# EAGLE board Cmde moteurs_5 (EAGLE 6.5.0), part 1 of 3
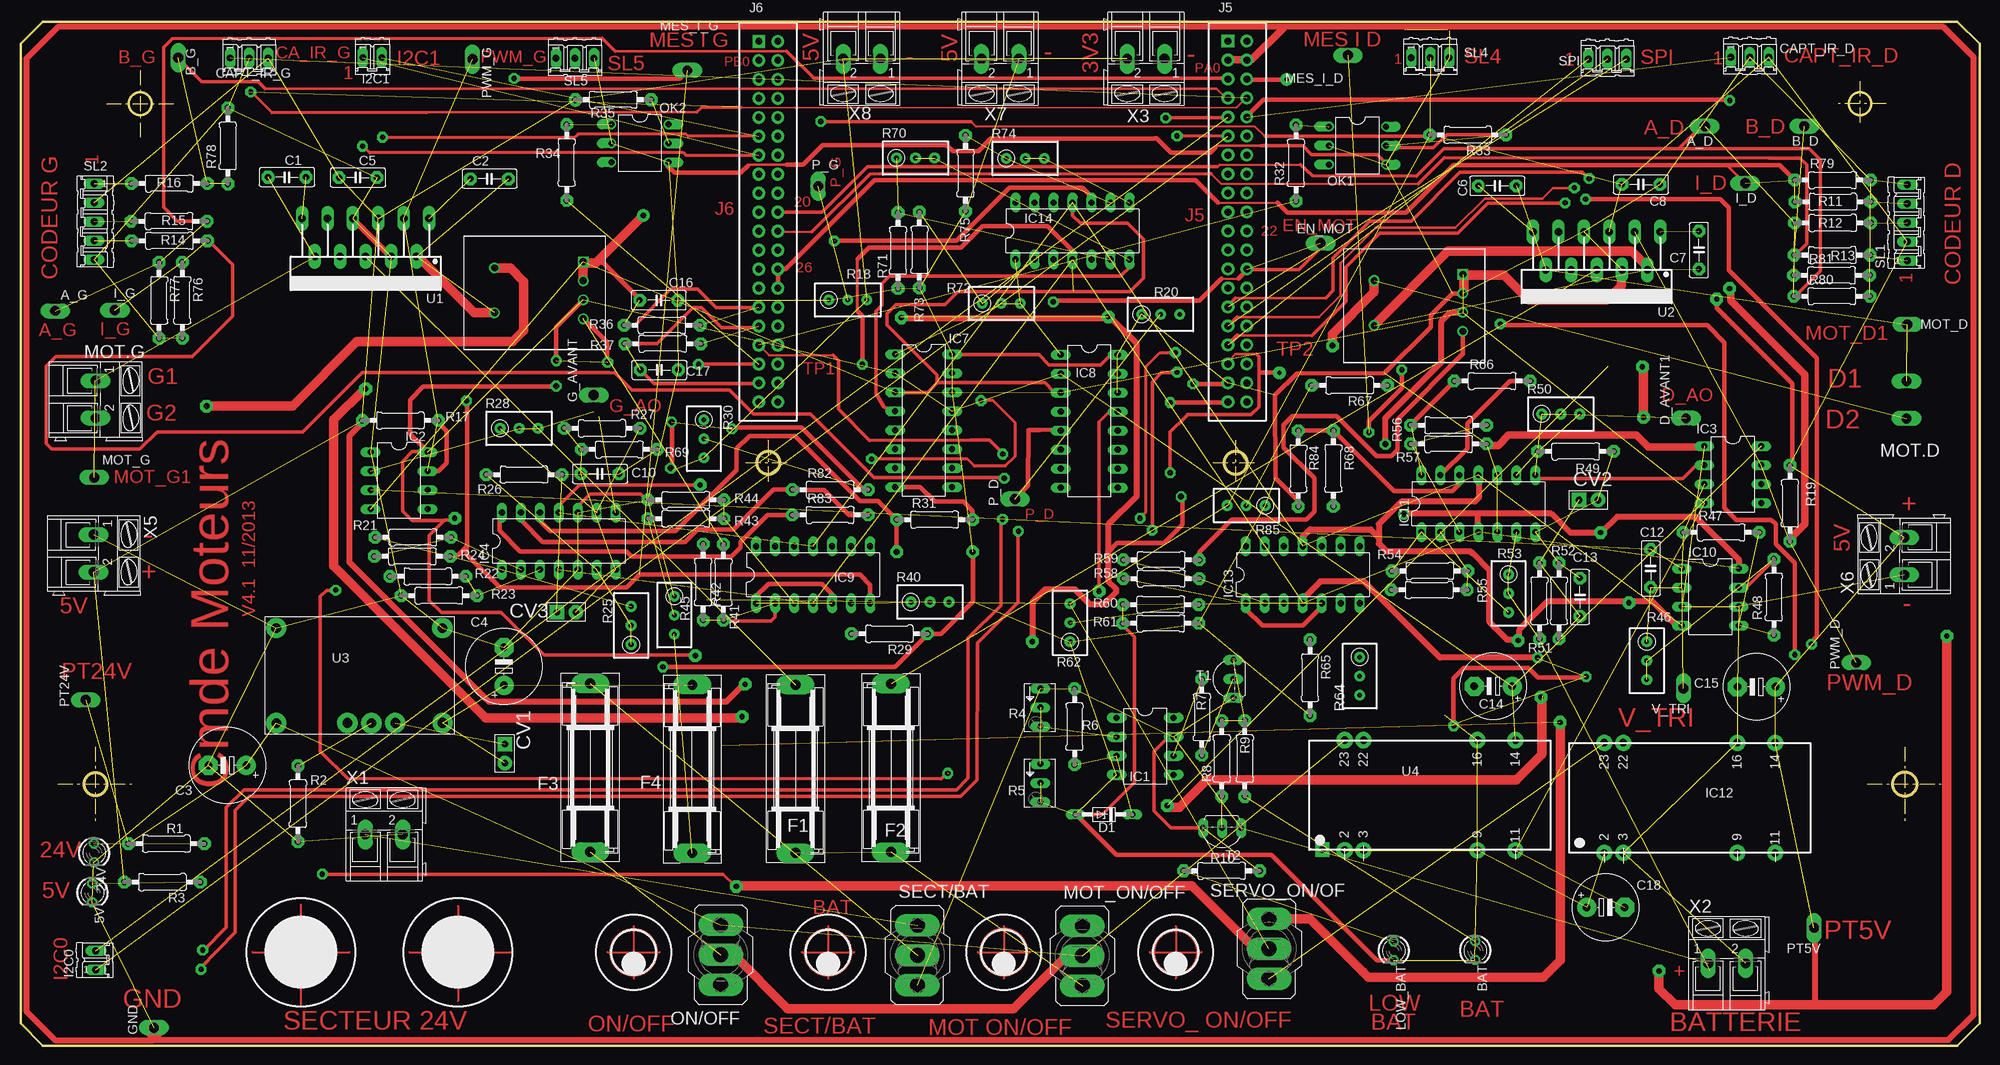
[diagram p3: board, top side]
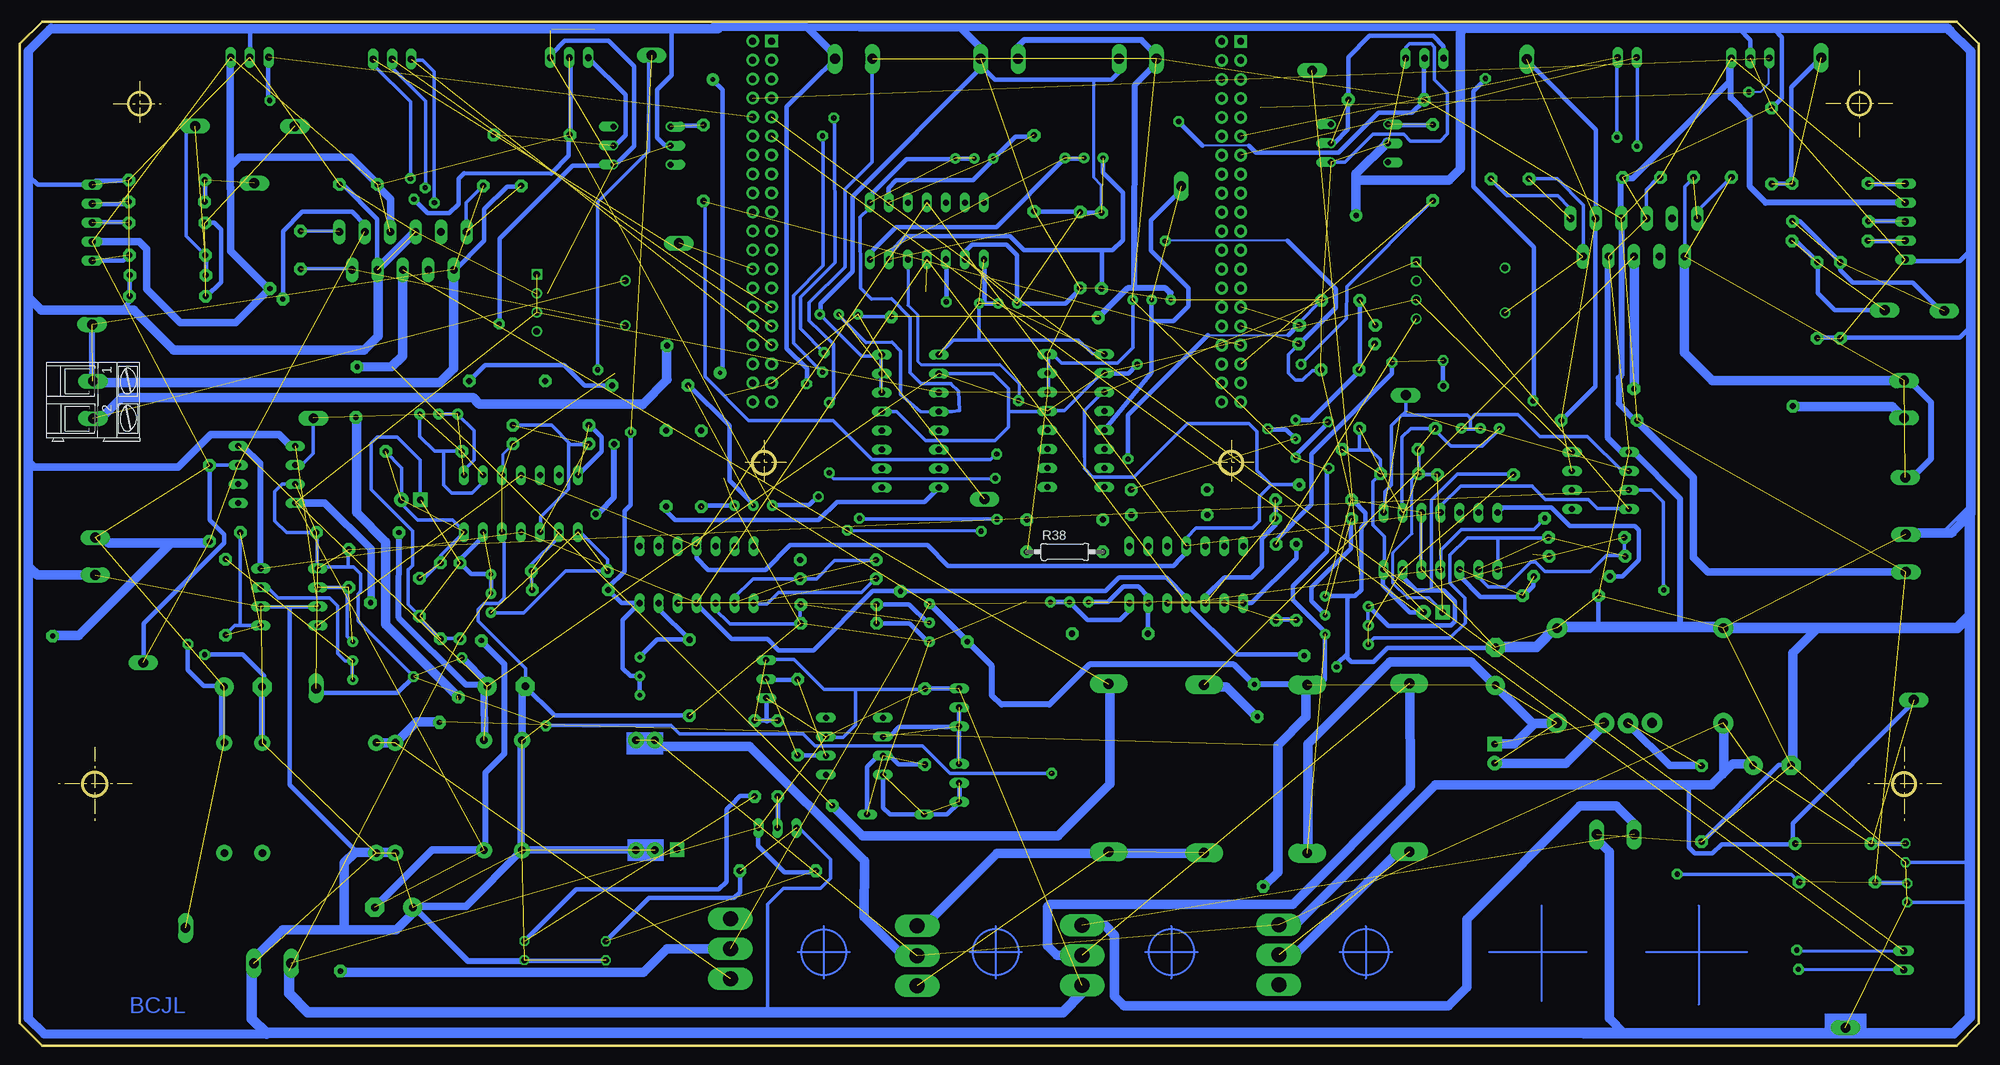
[diagram p4: board, bottom side, seen from below]

Size 262 x 137 mm. Coordinates in mm from the lower left corner, seen from the top.
Outline: 65,137 3,137
Outline: 3,137 259,137 262,134 262,3 259,0 3,0 0,3 0,134 3,137
Outline: 247,35 257,35
Outline: 252,40 252,30
Outline: 5,35 15,35
Outline: 10,40 10,30
Outline: 97,78 103,78
Outline: 100,81 100,75
Outline: 159.5,78 165.5,78
Outline: 162.5,81 162.5,75
Outline: 11.5,126 20.5,126
Outline: 16,130.5 16,121.5
Outline: 249.5,126 242.5,126
Outline: 246,129 246,123
Outline: circle at 10,35 radius 1.5
Outline: circle at 100,78 radius 1.5
Outline: circle at 162.5,78 radius 1.5
Outline: circle at 252,35 radius 1.58
Outline: circle at 246,126 radius 1.5
Outline: circle at 16,126 radius 1.5
Copper layers (1*16): Top 0.035mm / dielectric 1.5mm / Bottom 0.035mm
Design rules "default": minimum track width 10mil, minimum drill 24mil, track to track 8mil, track to pad 8mil, pad to pad 8mil, via to via 8mil, smd to smd 8mil, copper to edge 40mil, drill to drill 8mil, minimum pad ring 10mil, minimum via ring 8mil, stop-mask expansion 4mil, vias tented up to drill 0mil, thermal gap 10mil
tRestrict: area 97,75 to 103,81; area 159.5,75 to 165.5,81; area 249,124 to 255,130; area 249,32 to 255,38; area 7,32 to 13,38; area 7,124 to 13,130

## Footprints (pad centres in the part's own frame; a part is rotated, then mirrored left to right if it is on the bottom)
LED3MM = drill 0.813 octagon: A -1.27,0; K 1.27,0
P1-13Y = drill 1.321 pad 1.905 long: TP 0,0
C050-025X075 = drill 0.813 pad 1.676 octagon: 1 -2.54,0; 2 2.54,0
E5-10,5 = drill 1.016 pad 2.54: + -2.54,0 | drill 1.016 pad 2.54 octagon: - 2.54,0
E5-8,5 = drill 1.016 pad 2.54: + -2.54,0 | drill 1.016 pad 2.54 octagon: - 2.54,0
03P = drill 0.914 long: 1 -2.54,0; 2 0,0; 3 2.54,0
CAVALIER = drill 0.9 pad 1.93 square: 1 -1.27,0 | drill 0.9 pad 1.93: 2 1.27,0
DO34Z7 = drill 0.813 long: A 3.81,0; C -3.81,0
SH22,5 = drill 1.321 pad 2.54 long: 1 -11.252,0; 2 11.252,0
02P = drill 0.914 long: 1 -1.27,0; 2 1.27,0
DIL08 = drill 0.813 pad 1.27 long: 1 -3.81,-3.81; 2 -1.27,-3.81; 3 1.27,-3.81; 4 3.81,-3.81; 5 3.81,3.81; 6 1.27,3.81; 7 -1.27,3.81; 8 -3.81,3.81
DIL14 = drill 0.813 long: 1 -7.62,-3.81; 2 -5.08,-3.81; 3 -2.54,-3.81; 4 0,-3.81; 5 2.54,-3.81; 6 5.08,-3.81; 7 7.62,-3.81; 8 7.62,3.81; 9 5.08,3.81; 10 2.54,3.81; 11 0,3.81; 12 -2.54,3.81; 13 -5.08,3.81; 14 -7.62,3.81
DIL16 = drill 0.813 long: 1 -8.89,-3.81; 2 -6.35,-3.81; 3 -3.81,-3.81; 4 -1.27,-3.81; 5 1.27,-3.81; 6 3.81,-3.81; 7 6.35,-3.81; 8 8.89,-3.81; 9 8.89,3.81; 10 6.35,3.81; 11 3.81,3.81; 12 1.27,3.81; 13 -1.27,3.81; 14 -3.81,3.81; 15 -6.35,3.81; 16 -8.89,3.81
NDTS05505 = drill 1 pad 2.184: 2 -11.43,-7.36; 3 -8.89,-7.36; 9 6.35,-7.36; 11 11.43,-7.36; 14 11.43,7.36; 16 6.35,7.36; 22 -8.89,7.36; 23 -11.43,7.36
CON_FE20-2 = drill 0.9 pad 1.676 square: 1 -1.27,24.13 | drill 0.9 pad 1.676: 2 1.27,24.13; 3 -1.27,21.59; 4 1.27,21.59; 5 -1.27,19.05; 6 1.27,19.05; 7 -1.27,16.51; 8 1.27,16.51; 9 -1.27,13.97; 10 1.27,13.97; 11 -1.27,11.43; 12 1.27,11.43; 13 -1.27,8.89; 14 1.27,8.89; 15 -1.27,6.35; 16 1.27,6.35; 17 -1.27,3.81; 18 1.27,3.81; 19 -1.27,1.27; 20 1.27,1.27; 21 -1.27,-1.27; 22 1.27,-1.27; 23 -1.27,-3.81; 24 1.27,-3.81; 25 -1.27,-6.35; 26 1.27,-6.35; 27 -1.27,-8.89; 28 1.27,-8.89; 29 -1.27,-11.43; 30 1.27,-11.43; 31 -1.27,-13.97; 32 1.27,-13.97; 33 -1.27,-16.51; 34 1.27,-16.51; 35 -1.27,-19.05; 36 1.27,-19.05; 37 -1.27,-21.59; 38 1.27,-21.59; 39 -1.27,-24.13; 40 1.27,-24.13
AK300/2 = drill 1.321 long: 1 -2.515,0; 2 2.489,0
320-916 = drill 2.007 long: 1 0,4.013; 2 0,0; 3 0,-4.013
DIL06 = drill 0.813 offset: 1 -2.54,-3.81; 2 0,-3.81; 3 2.54,-3.81; 4 2.54,3.81; 5 0,3.81; 6 -2.54,3.81
0207/10 = drill 0.813 pad 1.676 octagon: 1 -5.08,0; 2 5.08,0
B64Y = drill 0.813 long: A 2.54,0; E -2.54,0; S 0,0
RTRIM3296W = drill 0.61 pad 1.422: 1 0,-2.54; 2 0,0; 3 0,2.54
05P = drill 0.914 long: 1 -5.08,0; 2 -2.54,0; 3 0,0; 4 2.54,0; 5 5.08,0
TO92-EBC = drill 0.813 long: B 0,-1.27; C 2.54,-1.27; E -2.54,-1.27
MULTIWATT_11 = drill 1 pad 1.676 long: 1 -8.5,-7.33; 2 -6.8,-2.25; 3 -5.1,-7.33; 4 -3.4,-2.25; 5 -1.7,-7.33; 6 0,-2.25; 7 1.7,-7.33; 8 3.4,-2.25; 9 5.1,-7.33; 10 6.8,-2.25; 11 8.5,-7.33
PTN78060 = drill 1.3 pad 2.7: 1 -11.12,6.36; 2 -11.11,-6.35; 3 -1.6,-6.34; 4 1.61,-6.35; 5 4.8,-6.34; 6 11.12,-6.34; 7 11.11,6.36
HX03 = drill 0.9 square: P1 0,-7.62 | drill 0.9: P2 0,-5.08; P3 0,-2.54; P4 0,0; P5 11.85,-6.8; P6 11.85,-0.8

## Placement (x,y rotation side)
5V  [LED3MM]  9.6,20.46 270 top
24V  [LED3MM]  9.82,25.78 270 top
A_D  PTR1PAD1-13Y  [P1-13Y]  225.24,122.99 90 top
A_G  PTR1PAD1-13Y  [P1-13Y]  4.65,98.3 270 top
B_D  PTR1PAD1-13Y  [P1-13Y]  238.58,123.02 270 top
B_G  PTR1PAD1-13Y  [P1-13Y]  21.1,132.15 0 top
BAT  Vert  [LED3MM]  194.54,12.72 270 top
C1  10n  [C050-025X075]  35.64,116.18 180 top
C2  10n  [C050-025X075]  62.73,115.95 180 top
C3  220µ  [E5-10,5]  27.67,37.49 180 top
C4  220µ  [E5-10,5]  64.65,50.74 90 top
C5  100n  [C050-025X075]  45.13,116.12 180 top
C6  10n  [C050-025X075]  197.5,115.03 0 top
C7  10n  [C050-025X075]  224.49,106.43 90 top
C8  100n  [C050-025X075]  216.72,115.2 180 top
C10  100n  [C050-025X075]  77.5,76.5 180 top
C12  1nF  [C050-025X075]  218.02,63.84 270 top
C13  100n  [C050-025X075]  208.55,60 270 top
C14  220µ  [E5-8,5]  196.97,48.09 180 top
C15  220µ  [E5-8,5]  232.17,48 180 top
C16  47nF  [C050-025X075]  85.36,99.72 0 top
C17  47nF  [C050-025X075]  85.44,90.4 0 top
C18  220µ  [E5-8,5]  212,18.5 0 top
CAPT_IR_D  [03P]  231.28,132.21 0 top
CAPT_IR_G  [03P]  30.57,132.12 0 top
CV1  [CAVALIER]  64.77,39.08 270 top
CV2  [CAVALIER]  209.71,73 0 top
CV3  [CAVALIER]  73,58 0 top
D1  20V  [DO34Z7]  144.89,30.92 180 top
D_AVANT1  PTR1PAD1-13Y  [P1-13Y]  222.76,83.93 90 top
EN_MOT  PTR1PAD1-13Y  [P1-13Y]  173.88,107.33 90 top
F1  [SH22,5]  103.64,37.03 270 top
F2  [SH22,5]  116.41,37.16 270 top
F3  [SH22,5]  76.18,37.19 270 top
F4  [SH22,5]  89.85,37.01 90 top
G_AVANT  PTR1PAD1-13Y  [P1-13Y]  76.67,87.02 90 top
GND  PTR1PAD1-13Y  [P1-13Y]  17.85,2.4 90 top
I2C0  [02P]  10.08,11.44 90 top
I2C1  [02P]  47.06,132.18 0 top
I_D  PTR1PAD1-13Y  [P1-13Y]  230.66,115.37 270 top
I_G  PTR1PAD1-13Y  [P1-13Y]  12.62,98.37 270 top
IC1  TL081P  [DIL08]  150.4,40.04 270 top
IC2  LM311N  [DIL08]  50.62,75.6 270 top
IC3  LM311N  [DIL08]  229,76.4 270 top
IC4  TL084P  [DIL14]  72,67.5 0 top
IC7  [DIL16]  120.78,83.62 270 top
IC8  [DIL16]  142.93,83.54 270 top
IC9  TL084P  [DIL14]  106,63 0 top
IC10  TL082P  [DIL08]  226,60 270 top
IC11  TL084P  [DIL14]  195,72.5 0 top
IC12  [NDTS05505]  223.25,33.15 0 top
IC13  TL084P  [DIL14]  171.5,63 0 top
IC14  TL084P  [DIL14]  140.7,108.99 0 top
J5  [CON_FE20-2]  162.75,110.24 0 top
J6  [CON_FE20-2]  100,110.23 0 top
LOW_BAT  Rouge  [LED3MM]  183.64,12.7 270 top
MES_I_D  PTR1PAD1-13Y  [P1-13Y]  177.53,132.47 270 top
MES_I_G  PTR1PAD1-13Y  [P1-13Y]  89.18,130.46 90 top
MOT.D  [AK300/2]  252.24,86.39 270 bottom
MOT.G  [AK300/2]  10.02,86.45 270 top
MOT_D  PTR1PAD1-13Y  [P1-13Y]  252.35,96.48 90 top
MOT_G  PTR1PAD1-13Y  [P1-13Y]  9.85,76.01 90 top
MOT_ON/OFF  [320-916]  142,12 0 top
OK1  4N27  [DIL06]  178.81,120.42 270 top
OK2  4N27  [DIL06]  82.85,120.71 270 top
ON/OFF  [320-916]  93.65,12.18 180 top
P_D  PTR1PAD1-13Y  [P1-13Y]  133,73.11 90 top
P_G  PTR1PAD1-13Y  [P1-13Y]  106.69,114.98 0 top
PT5V  PTR1PAD1-13Y  [P1-13Y]  239.86,15.75 180 top
PT24V  PTR1PAD1-13Y  [P1-13Y]  8.73,46.24 90 top
PWM_D  PTR1PAD1-13Y  [P1-13Y]  245.52,51.24 90 top
PWM_G  PTR1PAD1-13Y  [P1-13Y]  60.44,131.95 0 top
R1  2K  [0207/10]  19.51,27.03 180 top
R2  21K  [0207/10]  37.1,32.38 90 top
R3  270  [0207/10]  18.96,21.89 180 top
R4  22k  [B64Y]  136.4,45.24 270 top
R5  22k  [B64Y]  136.4,35.13 270 top
R6  6.2k  [0207/10]  140.97,42.67 90 top
R7  1k  [0207/10]  158,43.93 90 top
R8  1k  [0207/10]  160.65,38.41 90 top
R9  2k  [0207/10]  163.73,38.41 90 top
R10  2k  [0207/10]  160.64,23.39 0 top
R11  3K3  [0207/10]  242.38,112.88 180 top
R12  3K3  [0207/10]  242.36,110.06 180 top
R13  3K3  [0207/10]  242.3,105.75 180 top
R14  3K3  [0207/10]  19.93,107.67 0 top
R15  3K3  [0207/10]  19.88,110.29 0 top
R16  3K3  [0207/10]  19.91,115.33 0 top
R17  10k  [0207/10]  50.79,83.64 180 top
R18  10K  [RTRIM3296W]  110.64,99.75 270 top
R19  10k  [0207/10]  236.65,72.55 90 top
R20  10K  [RTRIM3296W]  152.47,97.84 270 top
R21  47k  [0207/10]  52.5,68 0 top
R22  47k  [0207/10]  54.46,62.78 180 top
R23  47k  [0207/10]  55.98,60.2 0 top
R24  47k  [0207/10]  52.4,65.46 0 top
R25  100k  [RTRIM3296W]  81.66,56.21 0 top
R26  10k  [0207/10]  67.34,76.39 180 top
R27  10k  [0207/10]  77.78,82.59 180 top
R28  100k  [RTRIM3296W]  66.68,82.58 270 top
R29  10k  [0207/10]  116.2,55.11 180 top
R30  1k  [RTRIM3296W]  91.4,81.19 180 top
R31  47k  [0207/10]  122.25,70.36 0 top
R32  470  [0207/10]  170.59,118.08 90 top
R33  4.7k  [0207/10]  193.56,121.84 180 top
R34  470  [0207/10]  73.04,118.14 270 top
R35  4.7k  [0207/10]  79.28,126.54 0 top
R36  0.6K  [0207/10]  85.8,96.38 0 top
R37  0.6K  [0207/10]  85.9,93.9 0 top
R38  47k  [0207/10]  122.26,66.06 0 bottom
R40  100k  [RTRIM3296W]  121.64,59.35 270 top
R41  47k  [0207/10]  94,62 270 top
R42  47k  [0207/10]  91.29,62.02 90 top
R43  47k  [0207/10]  89,70.5 0 top
R44  47k  [0207/10]  89,73 0 top
R45  1k  [RTRIM3296W]  87.42,57.59 180 top
R46  100K  [RTRIM3296W]  217.5,51.5 180 top
R47  3.3k  [0207/10]  227.46,68.66 0 top
R48  6.6k  [0207/10]  234.5,60 90 top
R49  10k  [0207/10]  208,79.5 0 top
R50  100K  [RTRIM3296W]  206,84.5 270 top
R51  10k  [0207/10]  203.14,59.5 270 top
R52  47k  [0207/10]  205.75,59.5 270 top
R53  100K  [RTRIM3296W]  199,60.5 180 top
R54  47k  [0207/10]  188.5,63.5 0 top
R55  47k  [0207/10]  188.4,60.97 180 top
R56  47k  [0207/10]  191,83 180 top
R57  47k  [0207/10]  191,80.5 0 top
R58  47k  [0207/10]  152.57,62.49 0 top
R59  47k  [0207/10]  152.57,64.98 0 top
R60  47k  [0207/10]  152.5,59 0 top
R61  47k  [0207/10]  152.5,56.5 0 top
R62  1k  [RTRIM3296W]  140.36,56.56 0 top
R64  100K  [RTRIM3296W]  179.11,49.45 180 top
R65  10k  [0207/10]  172.47,49.23 270 top
R66  47k  [0207/10]  196.84,88.92 0 top
R67  47k  [0207/10]  177.75,88.33 180 top
R68  47k  [0207/10]  175.59,77.21 270 top
R69  47k  [0207/10]  80.1,79.75 0 top
R70  50k  [RTRIM3296W]  119.7,118.74 270 top
R71  10k  [0207/10]  117.36,106.37 90 top
R72  50k  [RTRIM3296W]  131.18,99.29 270 top
R73  10k  [0207/10]  120.22,106.45 90 top
R74  50k  [RTRIM3296W]  134.36,118.69 270 top
R75  10k  [0207/10]  126.38,116.7 90 top
R76  6K6  [0207/10]  21.63,99.72 270 top
R77  6K6  [0207/10]  18.53,99.7 270 top
R78  6K6  [0207/10]  27.73,120.36 90 top
R79  6K6  [0207/10]  242.36,115.79 0 top
R80  6K6  [0207/10]  242.25,100.26 0 top
R81  6K6  [0207/10]  242.23,103.05 0 top
R82  47k  [0207/10]  108.3,74.37 0 top
R83  47k  [0207/10]  108.28,71 0 top
R84  47k  [0207/10]  170.89,77.2 270 top
R85  1k  [RTRIM3296W]  163.93,72.25 90 top
SECT/BAT  [320-916]  119.95,12.12 0 top
SERVO_ON/OF  [320-916]  166.99,12.98 0 top
SL1  Codeur D  [05P]  252.35,110.08 90 top
SL2  Codeur G  [05P]  9.85,110.22 270 top
SL4  [03P]  188.53,132.17 0 top
SL5  [03P]  74.14,132.07 0 top
SPI  [03P]  212.21,131.98 0 top
T1  BC327  [TO92-EBC]  160.92,49.04 90 top
T2  BC327  [TO92-EBC]  160.69,27.85 180 top
U1  LMD18200  [MULTIWATT_11]  46.15,103.32 180 top
U2  LMD18200  [MULTIWATT_11]  210.79,101.55 180 top
U3  [PTN78060]  45.32,49.5 0 top
U4  [NDTS05505]  188.5,33.5 0 top
U$1  HX03  [HX03]  192.9,95.54 180 top
U$2  HX03  [HX03]  75.25,97.25 180 top
V_TRI  V_TRI  [P1-13Y]  222.39,47.81 180 top
X1  [AK300/2]  48.62,28.25 0 top
X2  [AK300/2]  228.22,11.03 0 top
X3  3V3  [AK300/2]  150.5,132 180 top
X5  [AK300/2]  9.78,65.84 270 top
X6  [AK300/2]  251.94,65.49 90 top
X7  [AK300/2]  131,132 180 top
X8  [AK300/2]  112.5,132 180 top